# EAGLE schematic PCB (EAGLE 9.6.2)
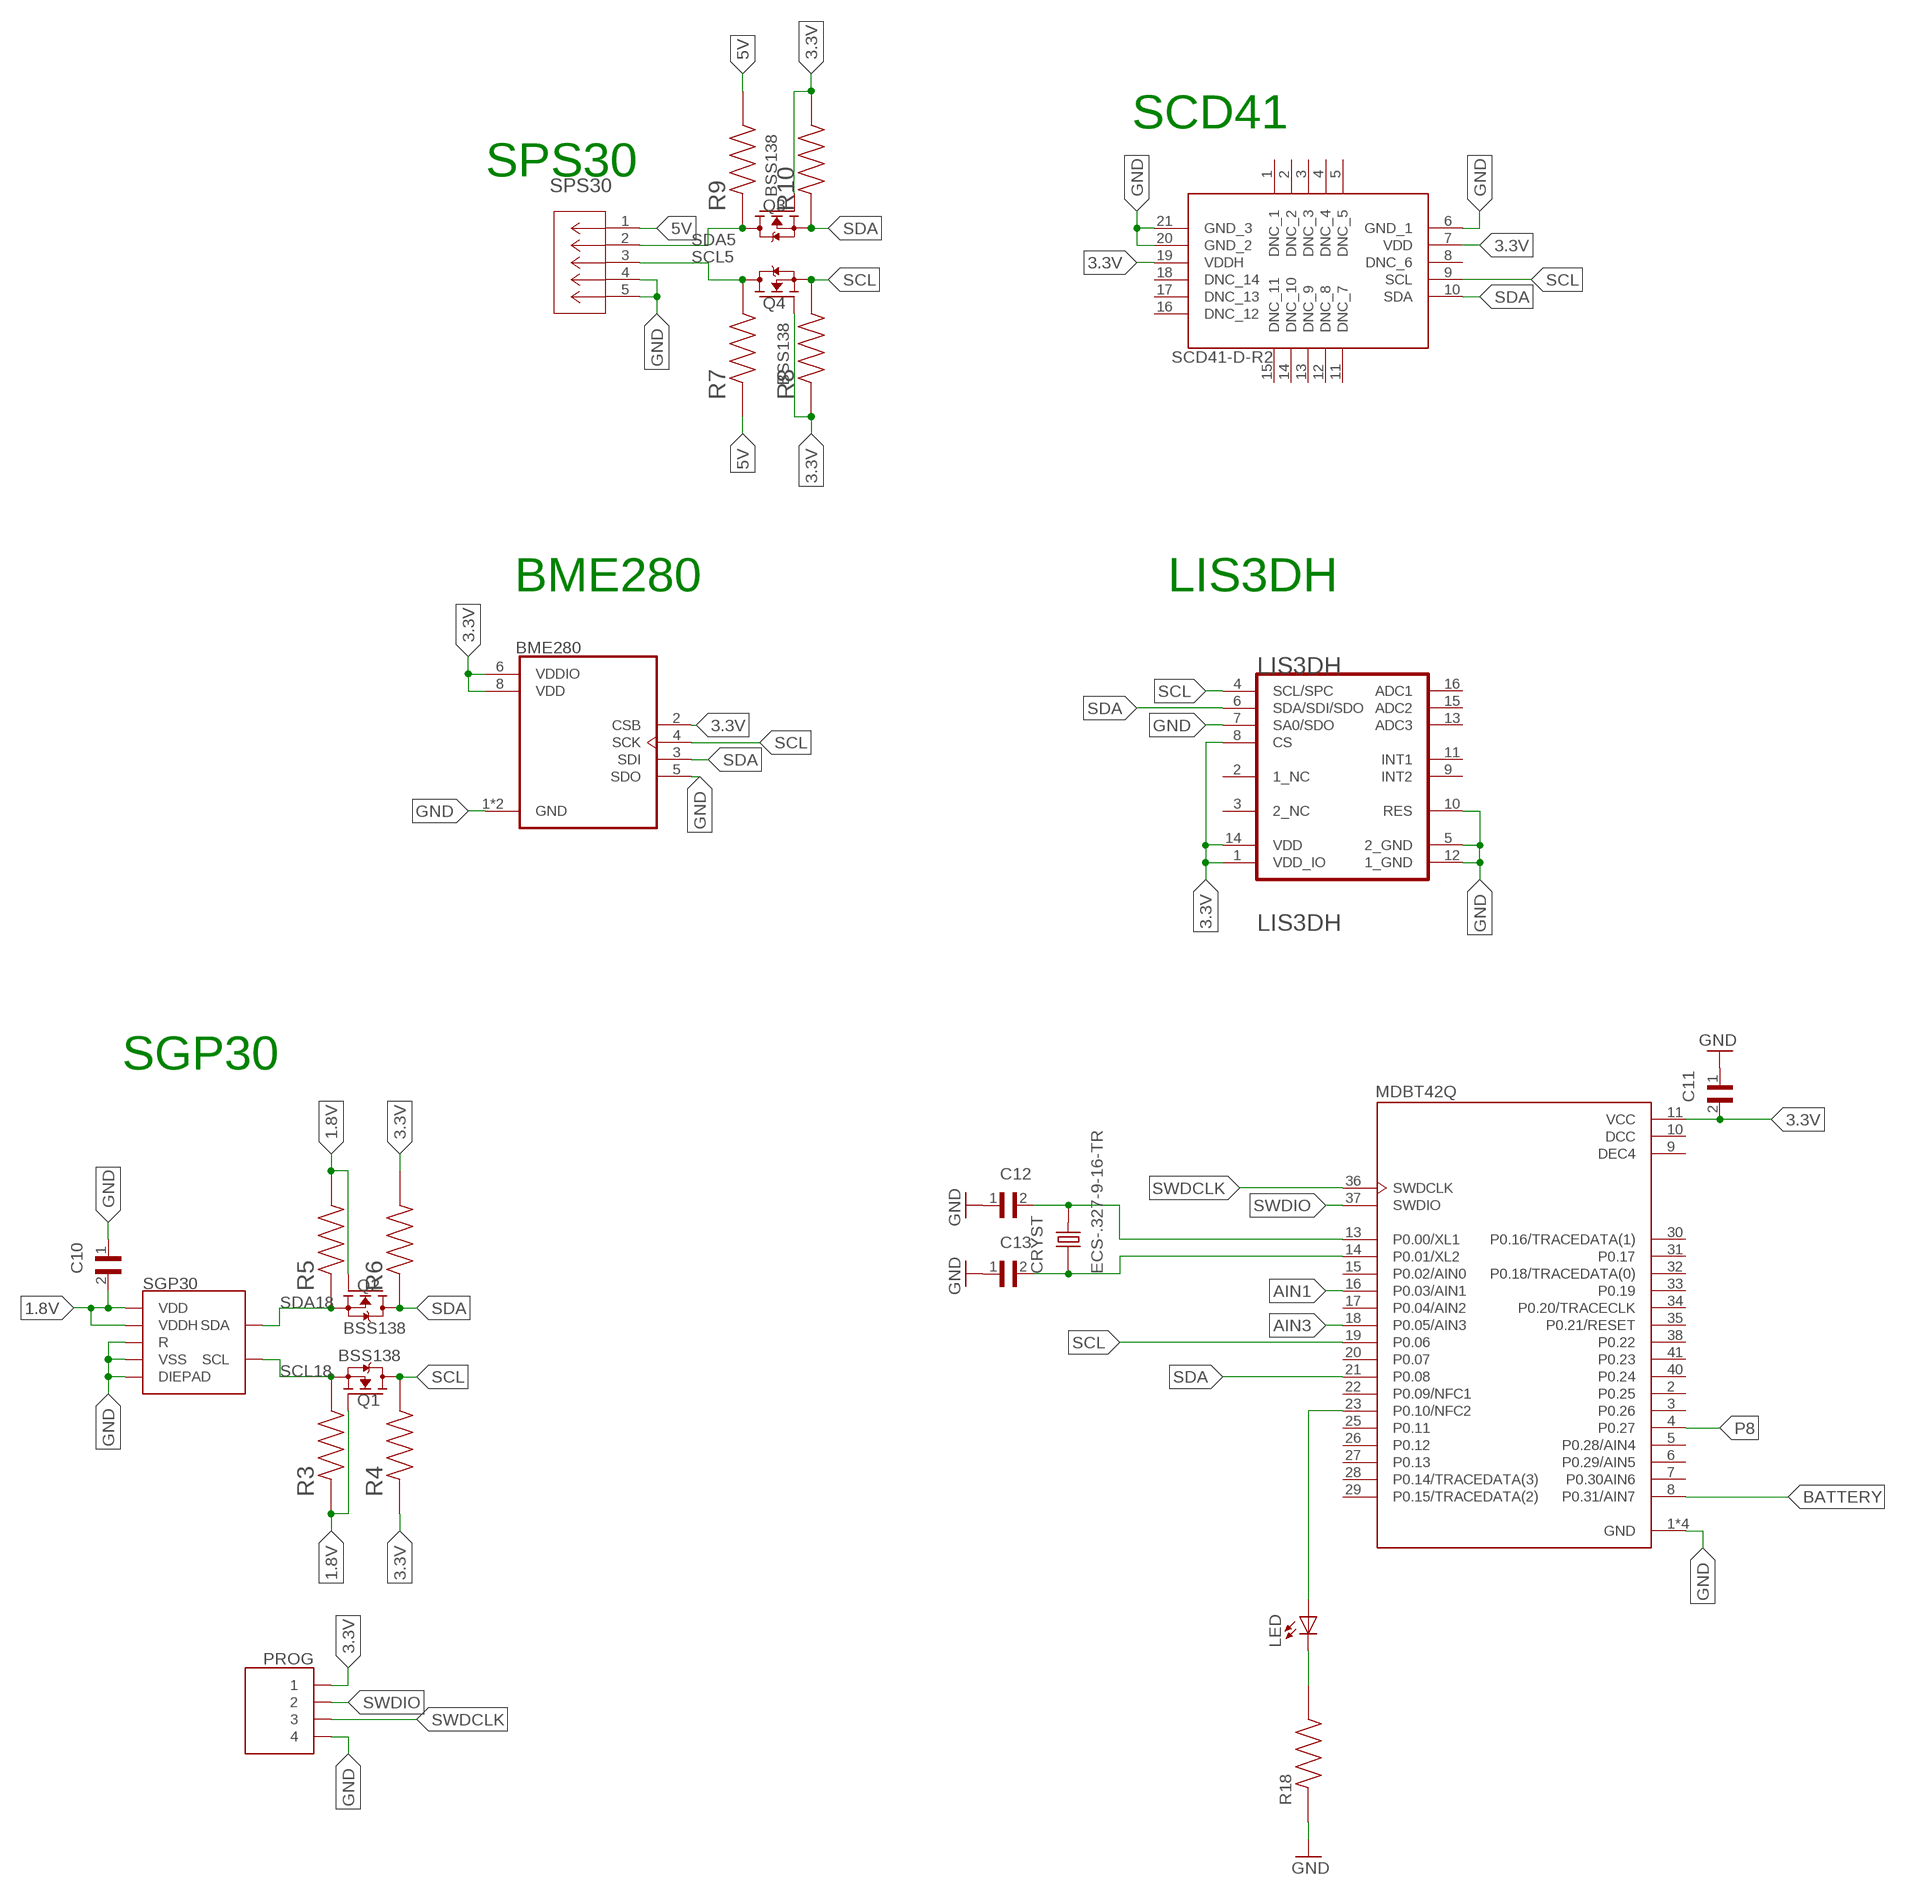
[diagram p0: schematic, sheet 1, part 1 of 2]
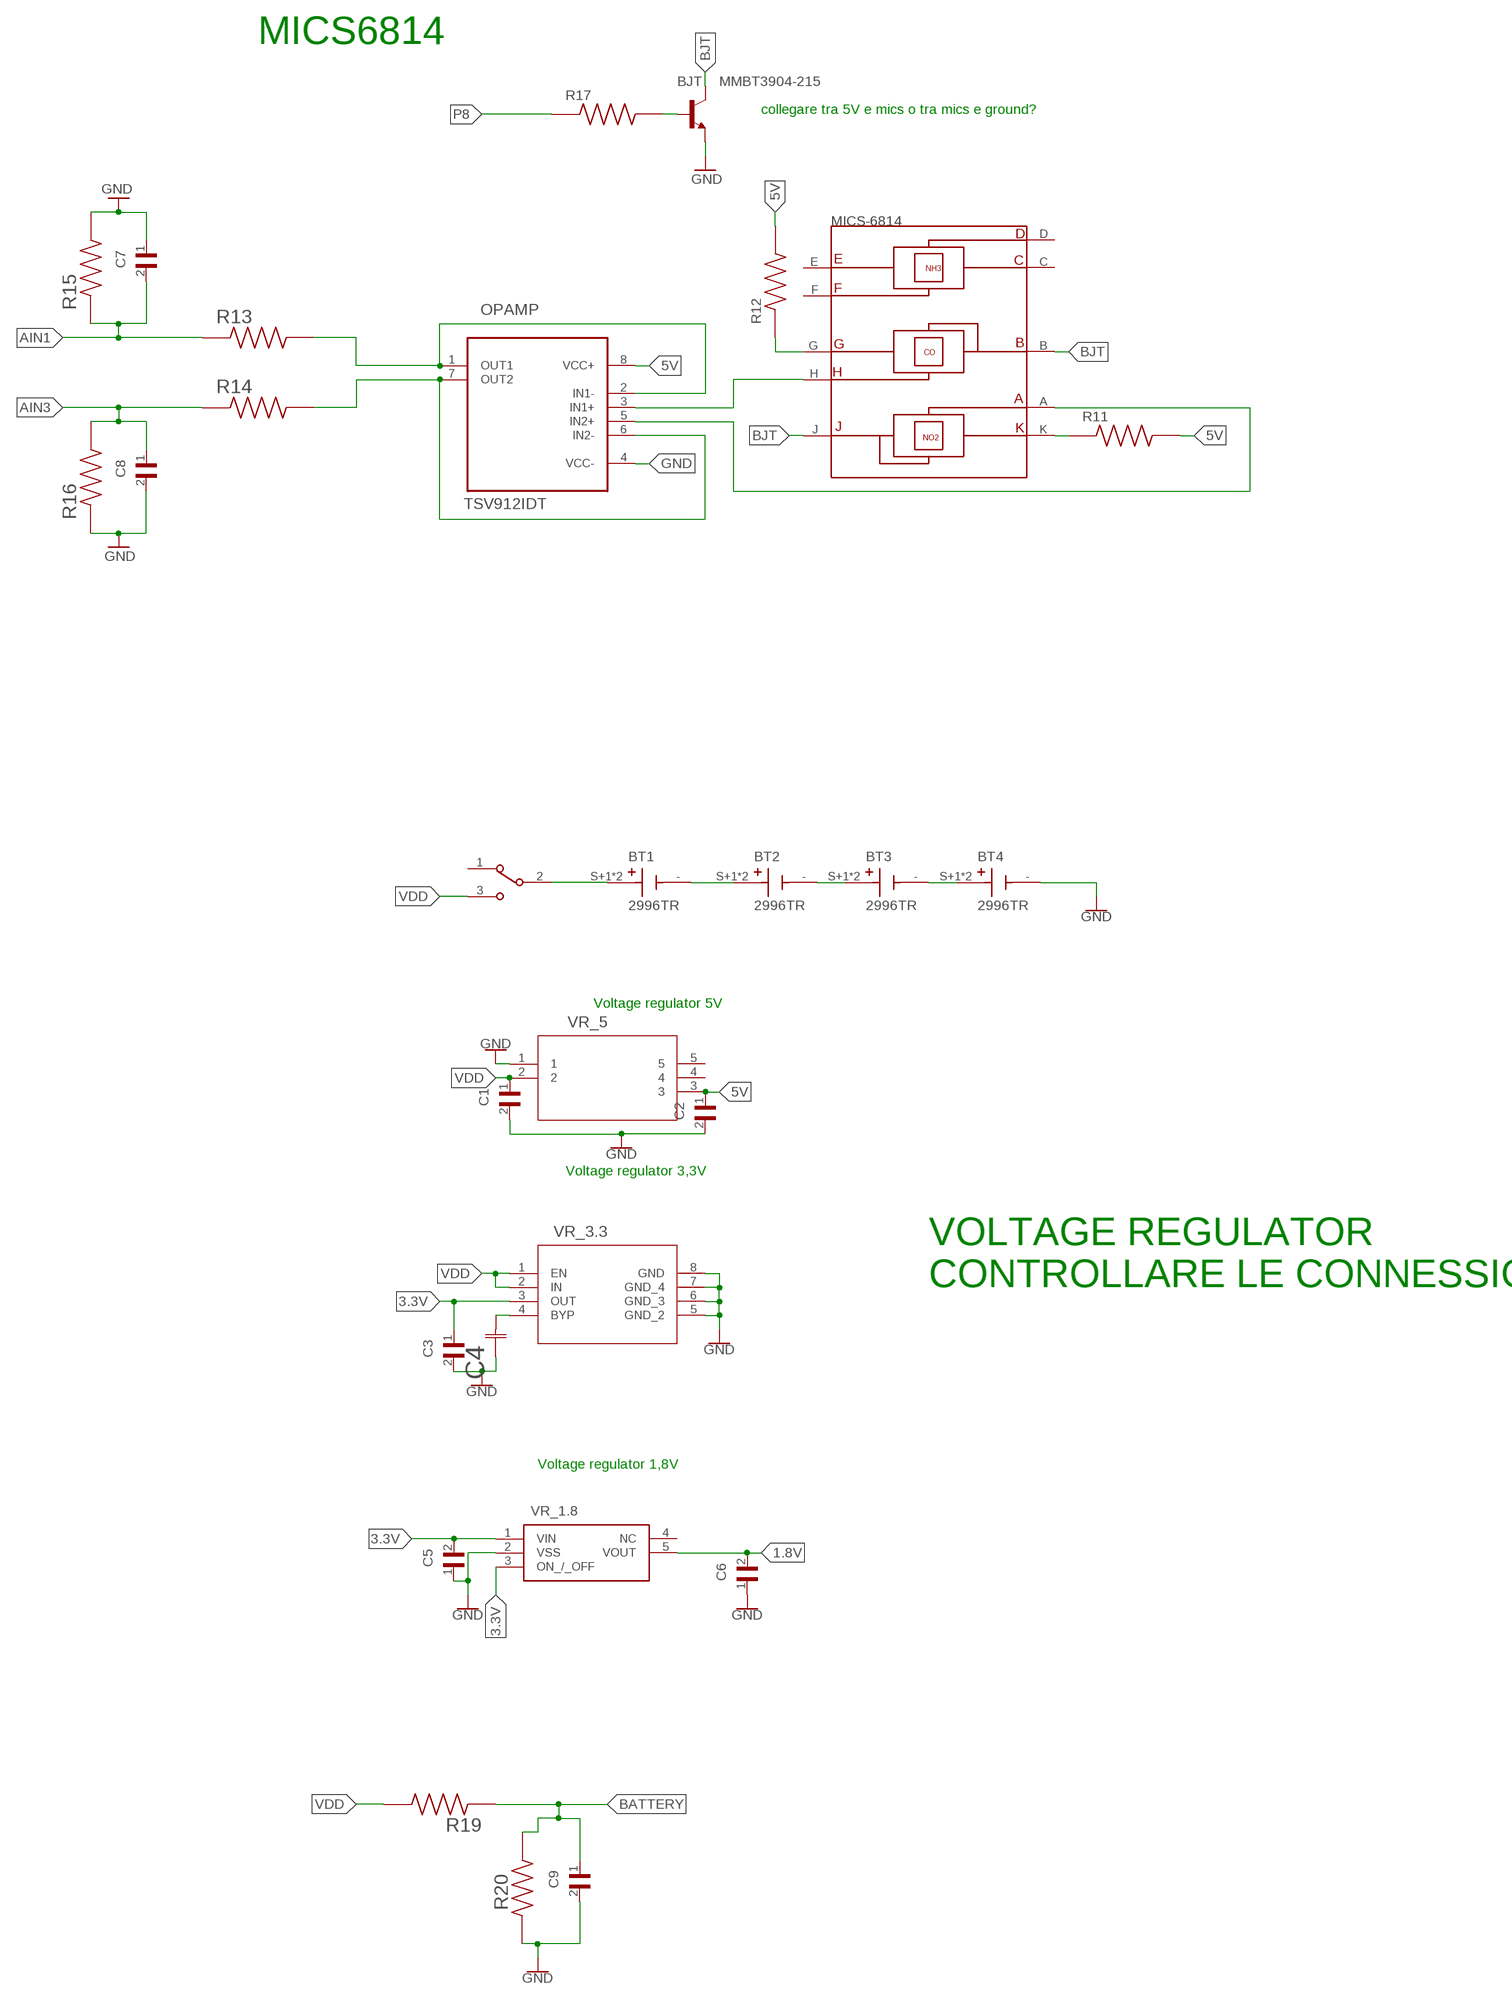
[diagram p1: schematic, sheet 1, part 2 of 2]

## Parts
BJT  MMBT3904-215  [SOT95P230X110-3N]
BME280  BME280  [PSON65P250X250X100-8N]
BT1  2996TR  [BAT_2996TR]
BT2  2996TR  [BAT_2996TR]
BT3  2996TR  [BAT_2996TR]
BT4  2996TR  [BAT_2996TR]
C1  C0402C104K9RACAUTO  [CAPC1005X55N]
C2  C0402C104K9RACAUTO  [CAPC1005X55N]
C3  CL05A225MQ5NNNC  [CAPC1005X55N]
C4  CL05B471KB5NNNCCAP_CL05_SAM  [CAP_CL05_SAM]
C5  JMK105BJ105KV-F  [CAPC1005X55N]
C6  JMK105BJ105KV-F  [CAPC1005X55N]
C7  CL05B103KO5NNNC  [CAPC1005X55N]
C8  CL05B103KO5NNNC  [CAPC1005X55N]
C9  CL05B103KO5NNNC  [CAPC1005X55N]
C10  C0402C104K9RACAUTO  [CAPC1005X55N]
C11  CL05A106MP5NUNC  [CAPC1005X55N]
C12  04025A120FAT2A  [CAPC1005X56N]
C13  04025A120FAT2A  [CAPC1005X56N]
CRYST  ECS-.327-9-16-TR  [XTAL_ECS-.327-9-16-TR]
LED  LTST-C170KRKT  [DIOC200X125X110]
LIS3DH  STMICROELECTRONICS_LIS3DHSTMICROELECTRONICS_LIS3DH_0_0  [STMICROELECTRONICS_LIS3DH_0]
MDBT42Q  317030213  [XCVR_317030213]
MICS6814  MICS-6814  [SENSOR_MICS-6814]
OPAMP  TSV912IDT  [SOIC127P600X175-8N]
PROG  BG306-04-A-1-0400-X-X_REVD  [GCT_BG306-04-A-1-0400-X-X_REVD]
Q1  BSS138  [SOT95P240X111-3N]
Q2  BSS138  [SOT95P240X111-3N]
Q3  BSS138  [SOT95P240X111-3N]
Q4  BSS138  [SOT95P240X111-3N]
R3  MCS0402MC1002FE000  [RESC1005X37N]
R4  MCS0402MC1002FE000  [RESC1005X37N]
R5  MCS0402MC1002FE000  [RESC1005X37N]
R6  MCS0402MC1002FE000  [RESC1005X37N]
R7  MCS0402MC1002FE000  [RESC1005X37N]
R8  MCS0402MC1002FE000  [RESC1005X37N]
R9  MCS0402MC1002FE000  [RESC1005X37N]
R10  MCS0402MC1002FE000  [RESC1005X37N]
R11  ERJPA2F1300X  [RES_ERJPA2F1300X]
R12  ERJPA2J821X  [RES_ERJPA2J821X]
R13  ERJ-2GEJ515X  [RESC1005X40N]
R14  ERJ-2GEJ515X  [RESC1005X40N]
R15  ERJ-2GEJ106X  [RESC1005X40N]
R16  ERJ-2GEJ106X  [RESC1005X40N]
R17  ERJPA2F5101X  [RES_ERJPA2F5101X]
R18  ERA2AEB331X  [RES_ERA2AEB331X]
R19  ERJ-2GEJ106X  [RESC1005X40N]
R20  ERJ-2GEJ106X  [RESC1005X40N]
S1  EG1213  [SW_EG1213]
SCD41  SCD41-D-R2  [SCD41DR2]
SGP30  SGP30  [SGP30]
SPS30  S5B-ZR-SM4A-TF_(LF)_(SN)CONN_S5B-ZR-SM4A-TF_JST  [CONN_S5B-ZR-SM4A-TF_JST]
VR_1.8  S-1318D18-M5T1U4  [SOT95P275X130-5N]
VR_3.3  MIC5219-3.3YMMMSOP-8LD-PL-1_MCH  [MSOP-8LD-PL-1_MCH]
VR_5  MC78LC50NTRGTSOT23-5_ONS  [TSOT23-5_ONS]

## Nets
1.8V: C6.2 C10.2 Q1.1(G) Q2.1(G) R3.1 R5.2 SGP30.1(VDD) SGP30.5(VDDH) VR_1.8.5(VOUT)
3.3V: BME280.2(CSB) BME280.6(VDDIO) BME280.8(VDD) C3.1 C5.2 C11.2 LIS3DH.1(VDD_IO) LIS3DH.8(CS) LIS3DH.14(VDD) MDBT42Q.11(VCC) PROG.1 Q3.1(G) Q4.1(G) R4.1 R6.2 R8.1 R10.2 SCD41.7(VDD) SCD41.19(VDDH) VR_1.8.1(VIN) VR_1.8.3(ON_/_OFF) VR_3.3.3(OUT)
5V: C2.1 OPAMP.8(VCC+) R7.1 R9.2 R11.2 R12.2 SPS30.1 VR_5.3
AIN1: C7.2 MDBT42Q.16(P0.03/AIN1) R13.1 R15.1
AIN3: C8.1 MDBT42Q.18(P0.05/AIN3) R14.1 R16.2
BATTERY: C9.1 MDBT42Q.8(P0.31/AIN7) R19.1 R20.1
BJT: BJT.3(C) MICS6814.B(RH1/RS1_RED) MICS6814.J(RH1/RS1_OX)
GND: BJT.2(E) BME280.1(GND) BME280.5(SDO) BME280.7(GND) BT4.- C1.2 C2.2 C3.2 C4.1 C5.1 C6.1 C7.1 C8.2 C9.2 C10.1 C11.1 C12.1 C13.1 LIS3DH.5(2_GND) LIS3DH.7(SA0/SDO) LIS3DH.10(RES) LIS3DH.12(1_GND) MDBT42Q.1(GND) MDBT42Q.12(GND) MDBT42Q.24(GND) MDBT42Q.39(GND) OPAMP.4(VCC-) PROG.4 R15.2 R16.1 R18.1 R20.2 SCD41.6(GND_1) SCD41.20(GND_2) SCD41.21(GND_3) SGP30.2(VSS) SGP30.4(R) SGP30.DIEPAD SPS30.4 SPS30.5 VR_1.8.2(VSS) VR_3.3.5(GND_2) VR_3.3.6(GND_3) VR_3.3.7(GND_4) VR_3.3.8(GND) VR_5.1
LED: LED.+ MDBT42Q.23(P0.10/NFC2)
N$2: BT1.- BT2.S+1(+) BT2.S+2(+)
N$4: BT2.- BT3.S+1(+) BT3.S+2(+)
N$6: MICS6814.A(RS2) OPAMP.5(IN2+)
N$7: OPAMP.6(IN2-) OPAMP.7(OUT2) R14.2
N$8: OPAMP.1(OUT1) OPAMP.2(IN1-) R13.2
N$9: LED.- R18.2
N$10: MICS6814.H(RS2_RED) OPAMP.3(IN1+)
N$11: MICS6814.G(RH2_RED) R12.1
N$13: MICS6814.K(RH2_OX) R11.1
N$14: C4.2 VR_3.3.4(BYP)
N$15: BJT.1(B) R17.2
N$17: C12.2 CRYST.2 MDBT42Q.13(P0.00/XL1)
N$18: C13.2 CRYST.1 MDBT42Q.14(P0.01/XL2)
N$25: BT3.- BT4.S+1(+) BT4.S+2(+)
N$27: BT1.S+1(+) BT1.S+2(+) S1.2
P8: MDBT42Q.4(P0.27) R17.1
SCL: BME280.4(SCK) LIS3DH.4(SCL/SPC) MDBT42Q.19(P0.06) Q1.3(D) Q4.2(S) R4.2 R8.2 SCD41.9(SCL)
SCL5: Q4.3(D) R7.2 SPS30.3
SCL18: Q1.2(S) R3.2 SGP30.6(SCL)
SDA: BME280.3(SDI) LIS3DH.6(SDA/SDI/SDO) MDBT42Q.21(P0.08) Q2.3(D) Q3.2(S) R6.1 R10.1 SCD41.10(SDA)
SDA5: Q3.3(D) R9.1 SPS30.2
SDA18: Q2.2(S) R5.1 SGP30.3(SDA)
SWDCLK: MDBT42Q.36(SWDCLK) PROG.3
SWDIO: MDBT42Q.37(SWDIO) PROG.2
VDD: C1.1 R19.2 S1.3 VR_3.3.1(EN) VR_3.3.2(IN) VR_5.2
Unconnected: LIS3DH.2(1_NC) LIS3DH.3(2_NC) LIS3DH.9(INT2) LIS3DH.11(INT1) LIS3DH.13(ADC3) LIS3DH.15(ADC2) LIS3DH.16(ADC1) MDBT42Q.2(P0.25) MDBT42Q.3(P0.26) MDBT42Q.5(P0.28/AIN4) MDBT42Q.6(P0.29/AIN5) MDBT42Q.7(P0.30AIN6) MDBT42Q.15(P0.02/AIN0) MDBT42Q.17(P0.04/AIN2) MDBT42Q.20(P0.07) MDBT42Q.22(P0.09/NFC1) MDBT42Q.25(P0.11) MDBT42Q.26(P0.12) MDBT42Q.27(P0.13) MDBT42Q.28(P0.14/TRACEDATA(3)) MDBT42Q.29(P0.15/TRACEDATA(2)) MDBT42Q.30(P0.16/TRACEDATA(1)) MDBT42Q.31(P0.17) MDBT42Q.32(P0.18/TRACEDATA(0)) MDBT42Q.33(P0.19) MDBT42Q.34(P0.20/TRACECLK) MDBT42Q.35(P0.21/RESET) MDBT42Q.38(P0.22) MDBT42Q.40(P0.24) MDBT42Q.41(P0.23) MICS6814.C(RH1_NH3) MICS6814.D(RS1_NH3) MICS6814.E(RH2_NH3) MICS6814.F(RS2_NH3) S1.1 SCD41.1(DNC_1) SCD41.2(DNC_2) SCD41.3(DNC_3) SCD41.4(DNC_4) SCD41.5(DNC_5) SCD41.8(DNC_6) SCD41.11(DNC_7) SCD41.12(DNC_8) SCD41.13(DNC_9) SCD41.14(DNC_10) SCD41.15(DNC_11) SCD41.16(DNC_12) SCD41.17(DNC_13) SCD41.18(DNC_14) VR_1.8.4(NC) VR_5.4 VR_5.5

## Notes on the sheet
- MICS6814
- collegare tra 5V e mics o tra mics e ground?
- SCD41
- SPS30
- BME280 | LIS3DH
- Voltage regulator 5V
- SGP30
- Voltage regulator 3,3V
- VOLTAGE REGULATOR
  CONTROLLARE LE CONNESSIONI
- Voltage regulator 1,8V

## Power pins joined to a net without a drawn wire
DCC: MDBT42Q.10(DCC)
DEC4: MDBT42Q.9(DEC4)

## Library data of the parts
BJT = BJT_TO-236:MMBT3904-215: MMBT3904 series 40V 200mA SOT23 NPN Switching Transistor; DESCRIPTION: Bipolar (BJT) Transistor NPN 40 V 200 mA 300MHz 250 mW Surface Mount TO-236AB; DIGI-KEY_PART_NUMBER: 1727-4044-2-ND; MF: Nexperia USA; MP: MMBT3904,215; PACKAGE: SOT23-3 Nexperia USA Inc.; PURCHASE-URL: https://pricing.snapeda.com/search/part/MMBT3904,215/?ref=eda
BME280 = BME280:BME280: DIGITAL HUMIDITY, PRESSURE AND TEMPERATURE SENSOR * Digital interface I²C (up to 3.4 MHz) and SPI (3 and 4 wire, up to 10 MHz)* Supply voltage VDD main supply voltage range: 1.71 V to 3.6 V*VDDIO interface voltage range: 1.2 V to 3.6 V Operating range -40…+85 °C, 0…100 % rel. humidity, 300…1100 hPa The library has been designed by Richard Magdycz <https://www.facebook.com/groups/eaglecadsoftUK> Check availability <https://pricing.snapeda.com/parts/BME280/Bosch/view-part?ref=eda>; AVAILABILITY: In Stock; DESCRIPTION: Board Mount Humidity Sensors MEMS humidity, pressure and temperature sensor; MF: Bosch; MP: BME280; PACKAGE: LGA-8 Bosch; PRICE: None; PURCHASE-URL: https://pricing.snapeda.com/search/part/BME280/?ref=eda
BT1-BT4 = Battery_holder:2996TR: Battery Retainer Coin, 11.6mm 1 Cell SMD (SMT) Tab; DESCRIPTION: SMT Holder for 11.6mm Cell-Tin Nickel Plated on T&R; DIGI-KEY_PART_NUMBER: 36-2996TR-ND; MF: Keystone Electronics; MP: 2996TR; PACKAGE: None; PURCHASE-URL: https://pricing.snapeda.com/search/part/2996TR/?ref=eda
C1 C2 C10 = Cond_100n_0402:C0402C104K9RACAUTO: Cap Ceramic 0.1uF 6.3V X7R 10% SMD 0402 125°C Punched Paper T/R; DESCRIPTION: 0.1 µF ±10% 6.3V Ceramic Capacitor X7R 0402 (1005 Metric); DIGI-KEY_PART_NUMBER: 399-19367-2-ND; MF: KEMET; MP: C0402C104K9RACAUTO; PACKAGE: 0402 KEMET; PURCHASE-URL: https://pricing.snapeda.com/search/part/C0402C104K9RACAUTO/?ref=eda
C3 = Cond_2,2u_0402:CL05A225MQ5NNNC: KC 2,2µF 0402 20% 6,3V X5R; DESCRIPTION: 2.2 µF ±20% 6.3V Ceramic Capacitor X5R 0402 (1005 Metric); DIGI-KEY_PART_NUMBER: 1276-1469-2-ND; MF: Samsung; MP: CL05A225MQ5NNNC; PACKAGE: 0402 Samsung; PURCHASE-URL: https://pricing.snapeda.com/search/part/CL05A225MQ5NNNC/?ref=eda
C4 = Cond_470p_0402:CL05B471KB5NNNC; COPYRIGHT: Copyright (C) 2022 Ultra Librarian. All rights reserved.; DIGI-KEY_PART_NUMBER_1: 1276-1566-2-ND; DIGI-KEY_PART_NUMBER_2: 1276-1566-1-ND; DIGI-KEY_PART_NUMBER_3: 1276-1566-6-ND; MANUFACTURER_PART_NUMBER: CL05B471KB5NNNC; MFR_NAME: Samsung
C5 C6 = Cond_1u_0402:JMK105BJ105KV-F: Cap Ceramic 1uF 6.3V X5R 10% Pad SMD 0402 85°C T/R; DESCRIPTION: 1 µF ±10% 6.3V Ceramic Capacitor X5R 0402 (1005 Metric); DIGI-KEY_PART_NUMBER: 587-1231-2-ND; MF: Taiyo Yuden; MP: JMK105BJ105KV-F; PACKAGE: 1005 Taiyo Yuden; PURCHASE-URL: https://pricing.snapeda.com/search/part/JMK105BJ105KV-F/?ref=eda
C7-C9 = Cond_10n_0402:CL05B103KO5NNNC: Cap Ceramic 0.01uF 16V X7R 10% SMD 0402 125°C Paper T/R; DESCRIPTION: 10000 pF ±10% 16V Ceramic Capacitor X7R 0402 (1005 Metric); DIGI-KEY_PART_NUMBER: 1276-1051-2-ND; MF: Samsung Electro-Mechanics; MP: CL05B103KO5NNNC; PACKAGE: 0402 Samsung; PURCHASE-URL: https://pricing.snapeda.com/search/part/CL05B103KO5NNNC/?ref=eda
C11 = Cond_10u_0402:CL05A106MP5NUNC: Cap Ceramic 10uF 10V X5R 20% SMD 0402 85C T/R; DESCRIPTION: 10 µF ±20% 10V Ceramic Capacitor X5R 0402 (1005 Metric); DIGI-KEY_PART_NUMBER: 1276-1450-2-ND; MF: Samsung; MP: CL05A106MP5NUNC; PACKAGE: 0402 Samsung; PURCHASE-URL: https://pricing.snapeda.com/search/part/CL05A106MP5NUNC/?ref=eda
C12 C13 = Cond_12p_0402:04025A120FAT2A: Cap Ceramic 12pF 50V C0G 1% SMD 0402 125°C Paper T/R; DESCRIPTION: 12 pF ±1% 50V Ceramic Capacitor C0G, NP0 0402 (1005 Metric); DIGI-KEY_PART_NUMBER: 478-10087-2-ND; MF: AVX; MP: 04025A120FAT2A; PACKAGE: 1005 AVX; PURCHASE-URL: https://pricing.snapeda.com/search/part/04025A120FAT2A/?ref=eda
CRYST = Crystal-ECS-.327-9-16-TR:ECS-.327-9-16-TR: SMD Tuning Fork Crystal; DESCRIPTION: 32.768 kHz ±20ppm Crystal 9pF 90 kOhms 2-SMD, No Lead; DIGI-KEY_PART_NUMBER: XC2132TR-ND; MF: ECS Inc.; MP: ECS-.327-9-16-TR; PACKAGE: SMD-2 ECS International; PURCHASE-URL: https://pricing.snapeda.com/search/part/ECS-.327-9-16-TR/?ref=eda
LED = LED_R_LTST-C170KRKT:LTST-C170KRKT: Green 2 x 1.25 x 1.1 mm 130° Water Clear 35 mcd 2 V Surface Mount LED; DESCRIPTION: Red 631nm LED Indication - Discrete 2V 0805 (2012 Metric); DIGI-KEY_PART_NUMBER: 160-1415-2-ND; MF: Lite-On Inc.; MP: LTST-C170KRKT; PACKAGE: None; PURCHASE-URL: https://pricing.snapeda.com/search/part/LTST-C170KRKT/?ref=eda
LIS3DH = STMicroelectronics - LIS3DH:STMICROELECTRONICS_LIS3DH: STM-LIS3DH-LGA-16; BANDWIDTH: 5 kHz; CIIVA_IDS: 978556; COMPONENT_LINK_1_DESCRIPTION: Manufacturer URL; COMPONENT_LINK_1_URL: http://www.st.com/; COMPONENT_LINK_3_DESCRIPTION: Package Specification; COMPONENT_LINK_3_URL: http://www.st.com/st-web-ui/static/active/en/resource/technical/document/datasheet/CD00274221.pdf; CURRENT_CONSUMPTION_IN_POWER_DOWN_MODE: 0.5 uA; DATASHEET: http://www.st.com/st-web-ui/static/active/en/resource/technical/document/datasheet/CD00274221.pdf; DATASHEET_VERSION: Rev. 1; FOOTPRINT_VARIANT_NAME_0: Manufacturer Recommended; IMPORTED: yes; IMPORTED_FROM: vault; IMPORT_TS: 1521860055; INTERFACE: I2C, SPI; MF: STMicroelectronics; MOUNTING_TECHNOLOGY: Surface Mount; MPN: LIS3DH; OPERATING_TEMPERATURE: -40 to 85 degC; OUTPUT_TYPE: Digital; PACKAGE: LGA-16; PACKAGE_DESCRIPTION: 16-Pin Land Grid Array, Body 3 x 3 mm, Pitch 0.5 mm; PACKING: Tray; PIN_0_0_3_INSIDE_EDGE: clock; PREFIX: U; RELEASE_DATE: 1506332602; ROHS: Yes; VAULT_GUID: 35EBCE1D-2944-446E-95F1-4BAFD91B2D9D; VAULT_REVISION: 2E44ACB8-410E-4D5A-8B6F-2E9483856AF3; WIDE_SUPPLY_VOLTAGE: 1.71 to 3.6 V
MDBT42Q = Raytac_nRF52:317030213: Mdbt42q Nrf52832 Based BLE Module; DESCRIPTION: Bluetooth Bluetooth v4.2 Transceiver Module 2.4GHz Integrated, Chip Surface Mount; DIGI-KEY_PART_NUMBER: 1597-1434-ND; MF: Seeed Technology; MP: 317030213; PACKAGE: SMD-41 Seeed Studio; PURCHASE-URL: https://pricing.snapeda.com/search/part/317030213/?ref=eda
MICS6814 = MICS-6814:MICS-6814: Three gas SMD NH3, CO and NO2 Check availability <https://pricing.snapeda.com/parts/MICS-6814/MikroElektronika/view-part?ref=eda>; AVAILABILITY: Not in stock; DESCRIPTION: MiCS-6814 Air Quality Sensor mikroBUS™ Click™ Platform Evaluation Expansion Board; MF: MikroElektronika; MP: MICS-6814; PACKAGE: None; PRICE: None
OPAMP = Opamp_SMD:TSV912IDT: operational amplifiers Check availability <https://pricing.snapeda.com/parts/TSV912IDT/STMicroelectronics/view-part?ref=eda>; AVAILABILITY: In Stock; DESCRIPTION: General Purpose Amplifier 2 Circuit Rail-to-Rail 8-SOIC; MF: STMicroelectronics; MP: TSV912IDT; PACKAGE: SOIC-8 STMicroelectronics; PRICE: None; PURCHASE-URL: https://pricing.snapeda.com/search/part/TSV912IDT/?ref=eda
PROG = Connet_6_BG306-04-A-1-0400-X-X_REVD:BG306-04-A-1-0400-X-X_REVD: 2.54mm Pitch Pin Socket,Single Row Vertical, Top Entry, Surface Mount, Natural LCP; DESCRIPTION: 4 Position Receptacle Connector 0.100 (2.54mm) Surface Mount Gold; DIGI-KEY_PART_NUMBER: 2073-BG306-04-A-1-0400-L-BTR-ND; MF: Global Connector Technology; MP: BG306-04-A-1-0400-L-B; PACKAGE: None; PURCHASE-URL: https://pricing.snapeda.com/search/part/BG306-04-A-1-0400-L-B/?ref=eda
Q1-Q4 = BSS138:BSS138: N-Channel 50V 220mA (Ta) 360mW (Ta) Surface Mount SOT-23-3; DESCRIPTION: N-Channel 50 V 200mA (Ta) 225mW (Ta) Surface Mount SOT-23-3 (TO-236); DIGI-KEY_PART_NUMBER: BSS138TR-ND; MF: ON Semiconductor; MP: BSS138; PACKAGE: SOT-23 ON; PURCHASE-URL: https://pricing.snapeda.com/search/part/BSS138/?ref=eda
R3-R10 = Res_10K_0402:MCS0402MC1002FE000: Res Thin Film 0402 10K Ohm 1% 1/10W ±50ppm/°C Molded SMD Paper T/R; DESCRIPTION: 10 kOhms ±1% 0.1W, 1/10W Chip Resistor 0402 (1005 Metric) Anti-Sulfur, Automotive AEC-Q200 Thin Film; DIGI-KEY_PART_NUMBER: MCS0402-10.0K-MFTR-ND; MF: Vishay Beyschlag; MP: MCS0402MC1002FE000; PACKAGE: 1005 Vishay; PURCHASE-URL: https://pricing.snapeda.com/search/part/MCS0402MC1002FE000/?ref=eda
R11 = Res_130_0402:ERJPA2F1300X; DESCRIPTION: 130 Ohms ±1% 0.2W, 1/5W Chip Resistor 0402 (1005 Metric) Automotive AEC-Q200, Pulse Withstanding Thick Film; DIGI-KEY_PART_NUMBER: P124437TR-ND; MF: Panasonic; MP: ERJPA2F1300X; PACKAGE: 1005-2 Panasonic; PURCHASE-URL: https://pricing.snapeda.com/search/part/ERJPA2F1300X/?ref=eda
R12 = Res_820_0402:ERJPA2J821X; DESCRIPTION: Res Thick Film 0402 820 Ohm 5% 0.2W(1/5W) ±200ppm/°C Pad SMD Automotive T/R; DIGI-KEY_PART_NUMBER: P124598TR-ND; MF: Panasonic; MP: ERJPA2J821X; PACKAGE: 1005-2 Panasonic; PURCHASE-URL: https://pricing.snapeda.com/search/part/ERJPA2J821X/?ref=eda
R13 R14 = Res_5,1M_0402:ERJ-2GEJ515X: RES, THICK FILM, 5M1, 5%, 0.1W, 0402; DESCRIPTION: 5.1 MOhms ±5% 0.1W, 1/10W Chip Resistor 0402 (1005 Metric) Automotive AEC-Q200 Thick Film; DIGI-KEY_PART_NUMBER: P5.1MJTR-ND; MF: Panasonic; MP: ERJ-2GEJ515X; PACKAGE: 1005 Panasonic Electronic Components; PURCHASE-URL: https://pricing.snapeda.com/search/part/ERJ-2GEJ515X/?ref=eda
R15 R16 R19 R20 = Res_10M_0402:ERJ-2GEJ106X: Res Thick Film 0402 10M Ohm 5% 0.1W(1/10W) -400ppm/C to 150ppm/C Pad SMD Automotive T/R; DESCRIPTION: Res Thick Film 0402 10M Ohm 5% 1/10W -400ppm/°C to 150ppm/°C Molded SMD Punched Carrier T/R; DIGI-KEY_PART_NUMBER: P10MJTR-ND; MF: Panasonic Electronic; MP: ERJ-2GEJ106X; PACKAGE: 1005 Panasonic Electronic Components; PURCHASE-URL: https://pricing.snapeda.com/search/part/ERJ-2GEJ106X/?ref=eda
R17 = Res_5,1K_0402:ERJPA2F5101X; DESCRIPTION: 5.1 kOhms ±1% 0.2W, 1/5W Chip Resistor 0402 (1005 Metric) Automotive AEC-Q200, Pulse Withstanding Thick Film; DIGI-KEY_PART_NUMBER: P124488TR-ND; MF: Panasonic; MP: ERJPA2F5101X; PACKAGE: 1005-2 Panasonic; PURCHASE-URL: https://pricing.snapeda.com/search/part/ERJPA2F5101X/?ref=eda
R18 = Res_330_0402:ERA2AEB331X; DESCRIPTION: 330 Ohms ±0.1% 0.063W, 1/16W Chip Resistor 0402 (1005 Metric) Automotive AEC-Q200 Thin Film; DIGI-KEY_PART_NUMBER: P330DCTR-ND; MF: Panasonic; MP: ERA2AEB331X; PACKAGE: 1005-2 Panasonic
S1 = switch_TH_HO:EG1213: EG Series SPDT On-On Right Angle Through Hole Slide Switch; DESCRIPTION: Slide Switch SPDT Through Hole, Right Angle; DIGI-KEY_PART_NUMBER: EG1906-ND; MF: E-Switch; MP: EG1213; PACKAGE: None; PURCHASE-URL: https://pricing.snapeda.com/search/part/EG1213/?ref=eda
SCD41 = SCD41-R2_unofficial:SCD41-D-R2: Air Quality Sensor CO2 Sensor 2.5V/3.3V/5V 20-Pin SMD EP Source: Datasheet <https://cz.mouser.com/datasheet/2/682/Sensirion_CO2_Sensors_SCD4x_Datasheet-2010009.pdf>; ARROW_PART_NUMBER: SCD41-D-R2; ARROW_PRICE-STOCK: https://www.arrow.com/en/products/scd41-d-r2/sensirion-ag?region=nac; DESCRIPTION: Air Quality Sensor CO2 Sensor 2.5V/3.3V/5V 20-Pin SMD EP; HEIGHT: 6.8mm; MANUFACTURER_NAME: Sensirion; MANUFACTURER_PART_NUMBER: SCD41-D-R2; MOUSER_PART_NUMBER: 403-SCD41-D-R2; MOUSER_PRICE-STOCK: https://www.mouser.co.uk/ProductDetail/Sensirion/SCD41-D-R2?qs=HBWAp0VN4Ri4o7ei4T3s0g%3D%3D
SGP30 = SGP30:SGP30: The SGP30 is a digital multi-pixel gas sensor designed for easy integration into air purifier, demand-controlled ventilation, and IoT applications. Check availability <https://pricing.snapeda.com/parts/SGP30/Sensirion%20AG/view-part?ref=eda>; AVAILABILITY: In Stock; DESCRIPTION: SGP30, SHTC1 Air Quality, Humidity, Temperature Sensor Arduino Platform Evaluation Expansion Board; MF: Sensirion AG; MP: SGP30; PACKAGE: None; PRICE: None; PURCHASE-URL: https://pricing.snapeda.com/search/part/SGP30/?ref=eda
SPS30 = CONN_SMD_5PIN:S5B-ZR-SM4A-TF_(LF)_(SN); COPYRIGHT: Copyright (C) 2022 Ultra Librarian. All rights reserved.; DIGI-KEY_PART_NUMBER_1: 455-1696-2-ND; DIGI-KEY_PART_NUMBER_2: 455-1696-1-ND; DIGI-KEY_PART_NUMBER_3: 455-1696-6-ND; MANUFACTURER_PART_NUMBER: S5B-ZR-SM4A-TF (LF) (SN); MFR_NAME: JST
VR_1.8 = VOLT_REG_1.8_SOT-23-5:S-1318D18-M5T1U4: IC REG LINEAR 1.8V 100MA SOT23-5 Source: Datasheet <https://www.ablic.com/en/doc/datasheet/voltage_regulator/S1318_E.pdf>; DESCRIPTION: IC REG LINEAR 1.8V 100MA SOT23-5; HEIGHT: 1.3mm; MANUFACTURER_NAME: ABLIC Inc.; MANUFACTURER_PART_NUMBER: S-1318D18-M5T1U4; MOUSER_PART_NUMBER: 628-S-1318D18-M5T1U4; MOUSER_PRICE-STOCK: https://www.mouser.co.uk/ProductDetail/ABLIC/S-1318D18-M5T1U4/?qs=bZr6mbWTK5mVILZBDijY2w%3D%3D
VR_3.3 = Volt_Reg_3.3_8MSOP:MIC5219-3.3YMM; COPYRIGHT: Copyright (C) 2022 Ultra Librarian. All rights reserved.; DIGI-KEY_PART_NUMBER_1: 576-1827-5-ND; MANUFACTURER_PART_NUMBER: MIC5219-3.3YMM; MFR_NAME: Microchip
VR_5 = VOLT_REG_5V_SOT-23-5:MC78LC50NTRG; COPYRIGHT: Copyright (C) 2022 Ultra Librarian. All rights reserved.; DIGI-KEY_PART_NUMBER_1: 2156-MC78LC50NTRG-OS-ND; DIGI-KEY_PART_NUMBER_2: =MC78LC50NTRG; DIGI-KEY_PART_NUMBER_3: MC78LC50NTRGOSCT-ND; DIGI-KEY_PART_NUMBER_4: MC78LC50NTRGOSDKR-ND; DIGI-KEY_PART_NUMBER_5: MC78LC50NTRGOSTR-ND; MANUFACTURER_PART_NUMBER: MC78LC50NTRG; MFR_NAME: onsemi